# EAGLE schematic avoccado-panel-multi-1 (EAGLE 7.2.0)
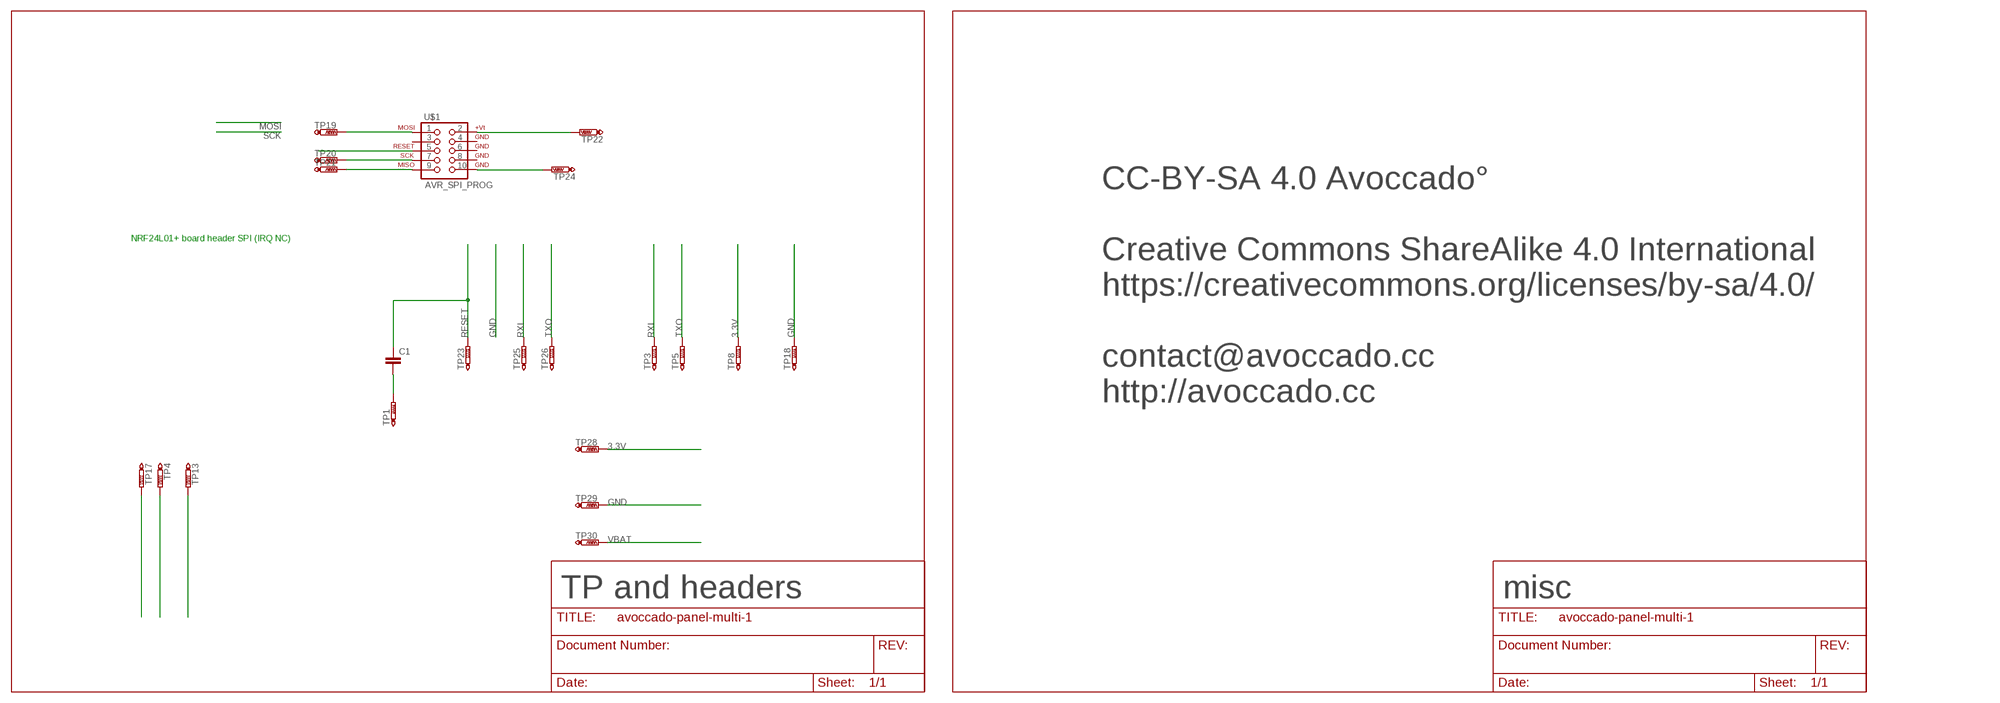
[diagram p0: schematic, sheet 1]

## Parts
C1  C-EUC0402  [C0402]
TP1  PTR1PAD1-13  [P1-13]
TP3  PTR1PAD1-13  [P1-13]
TP4  PTR1PAD1-13  [P1-13]
TP5  PTR1PAD1-13  [P1-13]
TP8  PTR1PAD1-13  [P1-13]
TP13  PTR1PAD1-13  [P1-13]
TP17  PTR1PAD1-13  [P1-13]
TP18  PTR1PAD1-13  [P1-13]
TP19  PTR1PAD1-13  [P1-13]
TP20  PTR1PAD1-13  [P1-13]
TP21  PTR1PAD1-13  [P1-13]
TP22  PTR1PAD1-13  [P1-13]
TP23  PTR1PAD1-13  [P1-13]
TP24  PTR1PAD1-13  [P1-13]
TP25  PTR1PAD1-13  [P1-13]
TP26  PTR1PAD1-13  [P1-13]
TP28  PTR1PAD1-13  [P1-13]
TP29  PTR1PAD1-13  [P1-13]
TP30  PTR1PAD1-13  [P1-13]
U$1  AVR_SPI_PROG  [AVR_ICSP]

## Nets
3.3V: TP8.TP TP22.TP TP28.TP U$1.2
D5: TP17.TP
D7: TP13.TP
D8: TP4.TP
DTR: C1.2 TP1.TP
GND [vcc]: TP18.TP TP24.TP TP29.TP U$1.10
MISO: TP21.TP U$1.9
MOSI: TP19.TP U$1.1
RESET: C1.1 TP23.TP U$1.5
RXI: TP3.TP TP25.TP
SCK: TP20.TP U$1.7
TXO: TP5.TP TP26.TP
VBAT [vcc]: TP30.TP
Unconnected: U$1.3 U$1.4 U$1.6 U$1.8

## Notes on the sheet
- NRF24L01+ board header SPI (IRQ NC)
- CC-BY-SA 4.0 Avoccado°
  
  Creative Commons ShareAlike 4.0 International
  https://creativecommons.org/licenses/by-sa/4.0/ 
  
  contact@avoccado.cc
  http://avoccado.cc
- TP and headers | misc

## Library data of the parts
C1 = rcl:C-EU: CAPACITOR, European symbol
TP1 TP3-TP5 TP8 TP13 TP17-TP26 TP28-TP30 = testpad:PTR1: TEST PIN
U$1 = SparkFun-Connectors:AVR_SPI_PROG: AVR 10-pin ICSP Header This is the standard AVR In Circuit Serial Programming header. Minimal, but includes pin one indicator. Works with standard Olimex programmers. Also look for the 6-pin reduced version. Spark Fun Electronics SKU: PRT-00778

## Net classes
1 vcc: width 0.152 mm
3 usbvcc: width 0.152 mm, drill 0.61 mm, clearance 0.152 mm